# Altium schematic sheet FC_Tracker_Ver_0_0.SchDoc
size A; SheetNumber: 1; SheetTotal: 1
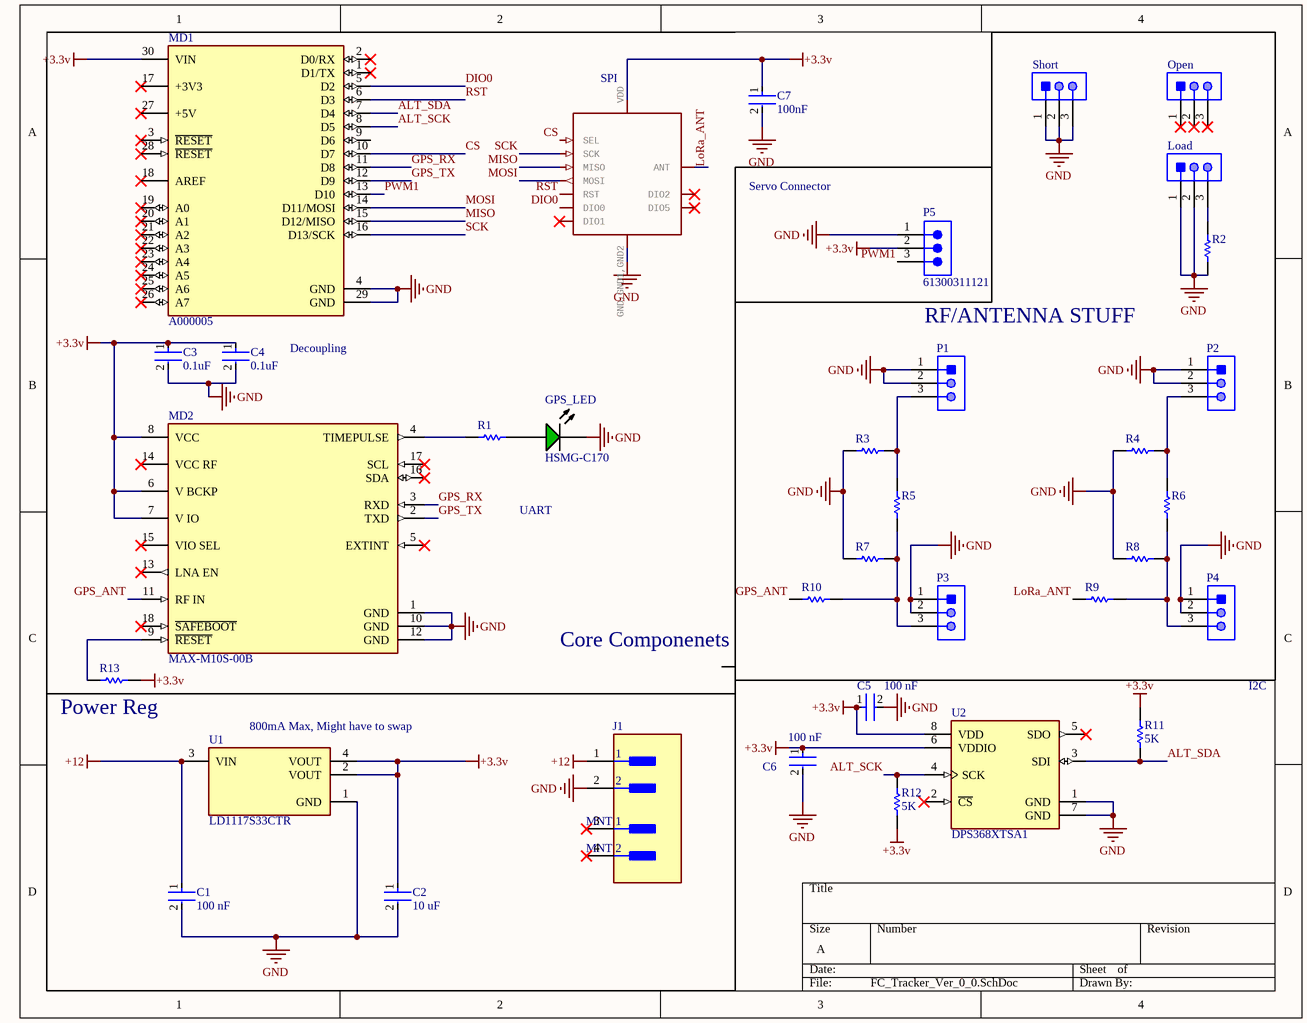
[diagram p0: FC_Tracker_Ver_0_0.SchDoc]

## Parts
1  _C2H_RFM95  [_C2H_RFM95]  (value not drawn)
C1  100 nF  [FP-CC0805-0_85-MFG]
C2  10 uF  [FP-CC0805-0_85-MFG]
C3  0.1uF  [FP-CC0805-0_85-MFG]
C4  0.1uF  [FP-CC0805-0_85-MFG]
C5  100 nF  [FP-CC0805-0_85-MFG]
C6  100 nF  [FP-CC0805-0_85-MFG]
C7  100nF  [FP-CC0805-0_85-MFG]
GPS_LED  HSMG-C170  [AVAG-HSMX-C170_V]
J1  SM02B-GHS-TB(LF)(SN)  [FP-SM02B-GHS-TB_LF_SN-MFG]  (value not drawn)
Load  U.FL-R-SMT-1(01)  [HRS-U.FL-R-SMT-3_V]  (value not drawn)
MD1  A000005  [FP-A000005-MFG]
MD2  MAX-M10S-00B  [FP-MAX-M10S-00B-MFG]
Open  U.FL-R-SMT-1(01)  [HRS-U.FL-R-SMT-3_V]  (value not drawn)
P1  U.FL-R-SMT-1(01)  [HRS-U.FL-R-SMT-3_V]  (value not drawn)
P2  U.FL-R-SMT-1(01)  [HRS-U.FL-R-SMT-3_V]  (value not drawn)
P3  U.FL-R-SMT-1(01)  [HRS-U.FL-R-SMT-3_V]  (value not drawn)
P4  U.FL-R-SMT-1(01)  [HRS-U.FL-R-SMT-3_V]  (value not drawn)
P5  61300311121  [61300311121]
R1  CRCW08050000Z0EA  [RESC2013X50X30LL20T20]  (value not drawn)
R2  CRCW08050000Z0EA  [RESC2013X50X30LL20T20]  (value not drawn)
R3  CRCW08050000Z0EA  [RESC2013X50X30LL20T20]  (value not drawn)
R4  CRCW08050000Z0EA  [RESC2013X50X30LL20T20]  (value not drawn)
R5  CRCW08050000Z0EA  [RESC2013X50X30LL20T20]  (value not drawn)
R6  CRCW08050000Z0EA  [RESC2013X50X30LL20T20]  (value not drawn)
R7  CRCW08050000Z0EA  [RESC2013X50X30LL20T20]  (value not drawn)
R8  CRCW08050000Z0EA  [RESC2013X50X30LL20T20]  (value not drawn)
R9  CRCW08050000Z0EA  [RESC2013X50X30LL20T20]  (value not drawn)
R10  CRCW08050000Z0EA  [RESC2013X50X30LL20T20]  (value not drawn)
R11  5K  [RESC1005X40X25LL05T05]
R12  5K  [RESC1005X40X25LL05T05]
R13  ERJ2GE0R00X  [RESC1005X40X25LL05T05]  (value not drawn)
Short  U.FL-R-SMT-1(01)  [HRS-U.FL-R-SMT-3_V]  (value not drawn)
U1  LD1117S33CTR  [FP-SOT-223-0046067_14-MFG]
U2  DPS368XTSA1  [FP-PG-VLGA-8-MFG]

## Nets
+3.3v: 1.VDD(VCC) C2.1 C3.1 C4.1 C5.1 C6.1 C7.1 MD1.30(VIN) MD2.6(V_BCKP) MD2.7(V_IO) MD2.8(VCC) P5.2 R11.2 R12.1 R13.2 U1.2(VOUT) U1.4(VOUT) U2.6(VDDIO) U2.8(VDD)
+12: C1.1 J1.1 U1.3(VIN)
GND: 1.GND,GND1,GND2(GND) C1.2 C2.2 C3.2 C4.2 C5.2 C6.2 C7.2 GPS_LED.2(K) J1.2 Load.1 Load.2 MD1.4(GND) MD1.29(GND) MD2.1(GND) MD2.10(GND) MD2.12(GND) P1.1 P1.2 P2.1 P2.2 P3.1 P3.2 P4.1 P4.2 P5.1 R2.1 R3.1 R4.2 R7.2 R8.2 Short.1 Short.2 Short.3 U1.1(GND) U2.1(GND) U2.7(GND)
ALT_SCK: MD1.8(D5) R12.2 U2.4(SCK)
ALT_SDA: MD1.7(D4) R11.1 U2.3(SDI)
CS: 1.NSS(SEL) MD1.10(D7)
DIO0: 1.DIO0 MD1.5(D2)
GPS_ANT: MD2.11(RF_IN) R10.1
GPS_RX: MD1.11(D8) MD2.3(RXD)
GPS_TX: MD1.12(D9) MD2.2(TXD)
LoRa_ANT: 1.ANT R9.1
MISO: 1.MISO MD1.15(D12/MISO)
MOSI: 1.MOSI MD1.14(D11/MOSI)
PWM1: MD1.13(D10) P5.3
RST: 1.RST MD1.6(D3)
SCK: 1.SCK MD1.16(D13/SCK)
NetGPS_LED_1: GPS_LED.1(A) R1.2
NetLoad_3: Load.3 R2.2
NetMD2_4: MD2.4(TIMEPULSE) R1.1
NetMD2_9: MD2.9(~{RESET}) R13.1
NetP1_3: P1.3 R3.2 R5.2
NetP2_3: P2.3 R4.1 R6.2
NetP3_3: P3.3 R5.1 R7.1 R10.2
NetP4_3: P4.3 R6.1 R8.1 R9.2

Not connected (* = marked no-connect by the designer): 1 DIO1* DIO2* DIO5*; J1 3(MNT_1)* 4(MNT_2)*; MD1 1(D1/TX)* 2(D0/RX)* 3(~{RESET})* 9(D6) 17(+3V3)* 18(AREF)* 19(A0)* 20(A1)* 21(A2)* 22(A3)* 23(A4)* 24(A5)* 25(A6)* 26(A7)* 27(+5V)* 28(~{RESET})*; MD2 5(EXTINT)* 13(LNA_EN)* 14(VCC_RF)* 15(VIO_SEL)* 16(SDA)* 17(SCL)* 18(~{SAFEBOOT})*; Open 1* 2* 3*; U2 2(~{CS})* 5(SDO)*

## Notes on the sheet
- (near 1) SPI
- Servo Connector
- Decoupling
- RF/ANTENNA STUFF
- UART
- Core Componenets
- I2C
- (near R13) Power Reg
- (near U1) 800mA Max, Might have to swap

## Library data of the parts
1 = _C2H_RFM95: GateName_1: G$1; SymbolName_1: _C2H_RFM95; LibraryName: AmbaSat-1v1-01-NO-solar; DeviceSetName: _C2H_RFM95; Package: _C2H_RFM95
C1 C5 C6 = CMP-2100-03606-3: Manufacturer Part Number: CC0805KRX7R9BB104; Manufacturer: Yageo; Tolerance: 0.1; Temperature Characteristic: X7R; Voltage Rating: 50 V; Material: Ceramic; Device Class L1: Passive Components; ComponentLink2Description: Datasheet; Package: CC0805-0.85; Digikey Description: CAP CER 0.1UF 50V X7R 0805; Capacitance: 100 nF; Device Class L3: Ceramic Capacitors; Value: 100 nF; Temperature: -30°C to +85°C; Height: 0.95mm; RoHS: TRUE; Ipc Land Pattern Name: CAPC200125X85; Device Class L2: Capacitors; Category: Cap; Temperature Range Low: -30°C; Temperature Range High: +85°C; Mouser Description: Multilayer Ceramic Capacitors MLCC - SMD/SMT 100nF 50V X7R 10%; Footprint Url: http://www.yageo.com/exep/pages/download/literatures/UPY-C_GEN_24.pdf; Automotive: No; Octopart: https://octopart.com/cc0805krx7r9bb104-yageo-192993; Lead Free: Yes; ComponentLink2URL: http://www.yageo.com/documents/recent/UPY-GPHC_Y5V_6.3V-to-50V_8.pdf
C2 = CMP-2100-03606-3: Manufacturer Part Number: CC0805KRX7R9BB104; Manufacturer: Yageo; Tolerance: 0.1; Capacitance: 100 nF; Value: 100 nF; Temperature Characteristic: X7R; Voltage Rating: 50 V; Material: Ceramic; Device Class L1: Passive Components; ComponentLink2Description: Datasheet; Package: CC0805-0.85; Digikey Description: CAP CER 0.1UF 50V X7R 0805; Device Class L3: Ceramic Capacitors; Temperature: -30°C to +85°C; Height: 0.95mm; RoHS: TRUE; Ipc Land Pattern Name: CAPC200125X85; Device Class L2: Capacitors; Category: Cap; Temperature Range Low: -30°C; Temperature Range High: +85°C; Mouser Description: Multilayer Ceramic Capacitors MLCC - SMD/SMT 100nF 50V X7R 10%; Footprint Url: http://www.yageo.com/exep/pages/download/literatures/UPY-C_GEN_24.pdf; Automotive: No; Octopart: https://octopart.com/cc0805krx7r9bb104-yageo-192993; Lead Free: Yes; ComponentLink2URL: http://www.yageo.com/documents/recent/UPY-GPHC_Y5V_6.3V-to-50V_8.pdf
C3 C4 = CMP-2100-03606-3: CAP CER 0.1UF 50V X7R 0805; Manufacturer Part Number: CC0805KRX7R9BB104; Manufacturer: Yageo; Tolerance: 0.1; Capacitance: 100 nF; Value: 100 nF; Material: Ceramic; Device Class L1: Passive Components; ComponentLink2Description: Datasheet; Package: CC0805-0.85; Digikey Description: CAP CER 0.1UF 50V X7R 0805; Device Class L3: Ceramic Capacitors; Temperature: -30°C to +85°C; Temperature Characteristic: X7R; Voltage Rating: 50 V; Height: 0.95mm; RoHS: TRUE; Ipc Land Pattern Name: CAPC200125X85; Device Class L2: Capacitors; Category: Cap; Temperature Range Low: -30°C; Temperature Range High: +85°C; Mouser Description: Multilayer Ceramic Capacitors MLCC - SMD/SMT 100nF 50V X7R 10%; Footprint Url: http://www.yageo.com/exep/pages/download/literatures/UPY-C_GEN_24.pdf; Automotive: No; Octopart: https://octopart.com/cc0805krx7r9bb104-yageo-192993; Lead Free: Yes; ComponentLink2URL: http://www.yageo.com/documents/recent/UPY-GPHC_Y5V_6.3V-to-50V_8.pdf
C7 = CMP-2100-03606-3: CAP CER 0.1UF 50V X7R 0805; Manufacturer Part Number: CC0805KRX7R9BB104; Manufacturer: Yageo; Tolerance: 0.1; Description: CC0805 100 nF X7R 10.00% 50 V; Material: Ceramic; Device Class L1: Passive Components; ComponentLink2Description: Datasheet; Package: CC0805-0.85; Digikey Description: CAP CER 0.1UF 50V X7R 0805; Capacitance: 100 nF; Device Class L3: Ceramic Capacitors; Value: 100 nF; Temperature: -30°C to +85°C; Temperature Characteristic: X7R; Voltage Rating: 50 V; Height: 0.95mm; RoHS: TRUE; Ipc Land Pattern Name: CAPC200125X85; Device Class L2: Capacitors; Category: Cap; Temperature Range Low: -30°C; Temperature Range High: +85°C; Mouser Description: Multilayer Ceramic Capacitors MLCC - SMD/SMT 100nF 50V X7R 10%; Footprint Url: http://www.yageo.com/exep/pages/download/literatures/UPY-C_GEN_24.pdf; Automotive: No; Octopart: https://octopart.com/cc0805krx7r9bb104-yageo-192993; Lead Free: Yes; ComponentLink2URL: http://www.yageo.com/documents/recent/UPY-GPHC_Y5V_6.3V-to-50V_8.pdf
GPS_LED = CMP-2000-05062-1: Chip LED, Green, 2.2 V, -40 to 85 degC, 2-Pin SMD, Pb-Free, Tape and Reel; Manufacturer: Avago; No. of Pins: 2; Peak Wavelength: 570nm; SVHC: NoSVHC(16-Jun-2014); Dominant Wavelength: 572nm; Forward Current If: 20mA; Viewing Angle: 170deg; Lens Shape: Rectangular; PIV Max: 5V; External Width: 1.25mm; LED Type: Standard; External Depth: 0.8mm; Opto Mounting Orientation: Top; Luminous Intensity: 15mcd; Luminous Intensity Min: 4mcd; Forward Voltage VF Max: 2.6V; External Length / Height: 2mm; Bulb Size: 1.25mmx1.4mm; Light Area Height: 1mm; Voltage Vf Typ: 2.2V; Operating Temperature Max: 85degC; Datasheet Version: Oct-08; MSL: MSL2A-4weeks; Peak Forward Current: 20mA; Package Description: 2-Pin Surface Mount Device, Body 2 x 1.25 mm, Height 0.8 mm; Datasheet URL: https://datasheet.ciiva.com/29280/180495-da-01-en-chip-led-hsmg-c170-gelb-gruen-29280971.pdf; Storage Temperature Min: -40degC; LED Colour: Green; Wavelength Typ: 570nm; Mounting Type: SMD; Forward Current If Max: 20mA; Dominant Wavelength Typ: 572nm; LED Mounting: SMD; Operating Temperature Range: -30degCto+85degC; Operating Temperature Min: -30degC; Manufacturer URL: http://www.avagotech.com/; Packaging: CutTape; Luminous Intensity Typ: 15mcd; Package Reference: HSMX-C170; Storage Temperature Max: 85degC; Opto Case Style: SMD; Forward Voltage: 2.2V
J1 = CMP-2000-07076-2: CONN HEADER SMD R/A 2POS 1.25MM; Voltage Rating: 50V; Number of Positions: 2; Pitch: 0.049inch; Current Rating: 1A; Connector Type: Outer Shroud Contact; Number of Rows: 1; Contact Material: Bronze; Termination: Solder; Color: Natural; Package Quantity: 2500; Mount: Surface Mount; Housing Color: Natural; Number of Contacts: 2; Packaging: Tape and Reel; Lead Free: Lead Free; Housing Material: Nylon; Orientation: Right Angle; Contact Type: Male Pin; Contact Plating: Tin; Series: GH; Fastening Type: Latch
Load Open P1-P4 Short = CMP-2000-05153-1: Ultra Small Coaxial Connector, 6 GHz, -40 to 90 degC, 3-Pin SMD, RoHS, Bulk; Manufacturer: Hirose Electric; Connector Style: U.FL; Impedance: 50Ohm; Dielectric Material: LiquidCrystalPolymer(LCP); Minimum Quantity: UltraMiniatureCoaxial; Online Catalog: U.FLSeries; Featured Product: HiroseU.FLSeries; Frequency - Max: 6GHz; Other Names: H122041 / U.FL-R-SMT-1(01)-ND; Contact Termination: Solder; Body Material: PhosphorBronze; Connector Type: Jack,MalePin; Body Finish: Silver; Center Contact Plating: Gold; Manufacturer URL: https://www.hirose.com; Family: CoaxialConnectors(RF); Fastening Type: Snap-On; Unit PriceUSD: U.FL; Series: U.FL; Package Reference: U.FL-R-SMT; Packaging: Bulk; Standard Package: 100; Mounting Type: SurfaceMount; Quantity Available: Bulk; Housing Color: Silver; Package Description: 3-Pin Surface Mount Device, Body 2.6 x 2.6 mm; Category: Connectors,Interconnects; Operating Temperature: -40degC~90degC; Center Contact Material: PhosphorBronze; Dynamic Catalog: U.FLSeries; Datasheet URL: https://datasheet.ciiva.com/26945/getdatasheetpartid-475239-26945414.pdf; Datasheet Version: Feb-09; Shield Termination: Solder
MD1 = CMP-189986-000002-1: ARDUINO NANO ATMEGA328 EVAL BRD; Number of Bits: 8; Evaluation Kit: Yes; Operating Supply Voltage: 12V; Interface: I2C; Data Bus Width: 8b; Core Architecture: AVR; Packaging: Bulk; Length: 7inch; Package Quantity: 50; Width: 5inch; REACH SVHC: No SVHC; Weight: 0.358383oz; Series: AVR® ATmega; Height: 0.25inch
MD2 = CMP-207130-000026-1: GNSS LCC RX, ROM, TCXO, LNA, SAW
P5 = CMP-1502-01062-3: NexarPartId: 32855521; Current Rating: 3A; Voltage Rating: 250V; Number of Positions: 3; Pitch: 2.54mm; Contact Resistance: 20mΩ; Connector Type: Male Pin; Gender: Male; REACH SVHC: Unknown; Packaging: Bulk; Contact Material: Copper; Min Operating Temperature: -40°C; Number of Rows: 1; Orientation: Vertical; RoHS: Compliant; Contact Plating: Gold; Max Operating Temperature: 105°C; Mount: Through Hole; Height: 8.94mm; Operating Supply Voltage: 250V; Number of Pins: 3; Contact Mating Length: 5.9944mm; Number of Contacts: 3; Color: Black; Lead Free: Lead Free; Lead Pitch: 2.54mm; Termination: Solder
R1 R3-R10 = CMP-2001-04896-1: Manufacturer: Vishay Dale; Part Number: CRCW08050000Z0EA
R2 = CMP-2001-04896-1: 50 Ohm; Manufacturer: Vishay Dale; Part Number: CRCW08050000Z0EA
R11 = CMP-2000-07451-1: 5KOhm; Manufacturer: Panasonic; Voltage Rating (DC): 50V; Temperature Coefficient: 600ppm/��C; Max Power Dissipation: 100mW; Resistance: 0mOhm; Tolerance: 5%; Number of Terminations: 2; Mount: SurfaceMount; Height: 0.35mm; Packaging: TapeandReel; Contact Plating: Tin; Manufacturer URL: http://www.panasonic.com/; Composition: ThickFilm; Max Operating Temperature: 155degC; REACH SVHC: NoSVHC; Case/Package: 0402; Package Reference: 402; Depth: 0.5mm; Package Description: 2-Pin Surface Mount Device, Body 1 x 0.5 mm; Datasheet URL: https://industrial.panasonic.com/cdbs/www-data/pdf/RDA0000/AOA0000C301.pdf; RoHSCompliant: True; Case Code (Imperial): 0402; Military Standard: Not; Min Operating Temperature: -55degC; Power Rating: 100mW; Datasheet Version: 03/2015; Length: 1mm; Case Code (Metric): 1005; Termination: SMD/SMT; Mounting Technology: SurfaceMount; Voltage Rating: 50V; Width: 0.02inch; Package Quantity: 1; Lead Free: LeadFree; Radiation Hardening: No
R12 = CMP-2000-07451-1: 5 KOhm; Manufacturer: Panasonic; Voltage Rating (DC): 50V; Temperature Coefficient: 600ppm/��C; Max Power Dissipation: 100mW; Resistance: 0mOhm; Tolerance: 5%; Number of Terminations: 2; Mount: SurfaceMount; Height: 0.35mm; Packaging: TapeandReel; Contact Plating: Tin; Manufacturer URL: http://www.panasonic.com/; Composition: ThickFilm; Max Operating Temperature: 155degC; REACH SVHC: NoSVHC; Case/Package: 0402; Package Reference: 402; Depth: 0.5mm; Package Description: 2-Pin Surface Mount Device, Body 1 x 0.5 mm; Datasheet URL: https://industrial.panasonic.com/cdbs/www-data/pdf/RDA0000/AOA0000C301.pdf; RoHSCompliant: True; Case Code (Imperial): 0402; Military Standard: Not; Min Operating Temperature: -55degC; Power Rating: 100mW; Datasheet Version: 03/2015; Length: 1mm; Case Code (Metric): 1005; Termination: SMD/SMT; Mounting Technology: SurfaceMount; Voltage Rating: 50V; Width: 0.02inch; Package Quantity: 1; Lead Free: LeadFree; Radiation Hardening: No
R13 = CMP-2000-07451-1: Chip Resistor, 0 Ohm, 0.1 W, -55 to 155 degC, 0402 (1005 Metric), RoHS, Tape and Reel; Manufacturer: Panasonic; Voltage Rating (DC): 50V; Temperature Coefficient: 600ppm/��C; Max Power Dissipation: 100mW; Resistance: 0mOhm; Tolerance: 5%; Number of Terminations: 2; Mount: SurfaceMount; Height: 0.35mm; Packaging: TapeandReel; Contact Plating: Tin; Manufacturer URL: http://www.panasonic.com/; Composition: ThickFilm; Max Operating Temperature: 155degC; REACH SVHC: NoSVHC; Case/Package: 0402; Package Reference: 402; Depth: 0.5mm; Package Description: 2-Pin Surface Mount Device, Body 1 x 0.5 mm; Datasheet URL: https://industrial.panasonic.com/cdbs/www-data/pdf/RDA0000/AOA0000C301.pdf; RoHSCompliant: True; Case Code (Imperial): 0402; Military Standard: Not; Min Operating Temperature: -55degC; Power Rating: 100mW; Datasheet Version: 03/2015; Length: 1mm; Case Code (Metric): 1005; Termination: SMD/SMT; Mounting Technology: SurfaceMount; Voltage Rating: 50V; Width: 0.02inch; Package Quantity: 1; Lead Free: LeadFree; Radiation Hardening: No
U1 = CMP-0244-00307-2: IC REG LINEAR 3.3V 800MA SOT223; Input Bias Current: 5mA; Output Voltage Accuracy: 1%; Dropout Voltage: 1.1V; Power Dissipation: 12W; Polarity: Positive; Min Input Voltage: 5.3V; Quiescent Current: 10mA; Max Output Current: 1.3A; Output Current: 950mA; Number of Regulators: 1; Max Supply Voltage: 15V; Output Type: Fixed; Output Voltage: 3.3V; Number of Terminals: 4; Min Supply Voltage: 3.3V; Termination: SMD/SMT; Mount: Surface Mount; Max Power Dissipation: 12W; Case/Package: SOT-223; Lead Free: Lead Free; Height: 1.8mm; REACH SVHC: No SVHC; Radiation Hardening: No; Width: 3.5mm; Length: 6.5mm; Packaging: Tape and Reel; Max Input Voltage: 15V; Accuracy: 1%; Weight: 0.01lb; Contact Plating: Tin; Max Operating Temperature: 125°C; Number of Pins: 4; Max Output Voltage: 3.3V; Min Operating Temperature: -40°C; Nominal Output Voltage: 3.3V; Package Quantity: 1; Min Output Voltage: 3.3V; Number of Outputs: 1
U2 = CMP-32885-000001-1: DIGITAL PRESSURE SENSOR; Manufacturer: Infineon; Port Style: No Port; Operating Supply Current: 345uA; Min Supply Voltage: 1.2V; Sensor Output: I2C,SPI; Max Supply Voltage: 3.6V; Ambient Temperature Range Low: -40°C; Temperature: -40°C to +85°C; Ambient Temperature Range High: +85°C; Device Class L2: Pressure Sensors; ComponentLink2Description: Datasheet; Footprint Url: https://www.infineon.com/cms/en/product/packages/PG-VLGA/PG-VLGA-8-2/; Category: IC; Lead Free: Yes; RoHS: TRUE; Temperature Range High: +85°C; Manufacturer Part Number: DPS368XTSA1; Digikey Description: DIGITAL PRESSURE SENSOR; ComponentLink2URL: https://www.infineon.com/dgdl/Infineon-DPS368-DataSheet-v01_01-EN.pdf?fileId=5546d46269e1c019016a0c45105d4b40; Height: 1.1mm; Package: PG-VLGA-8; Device Class L1: Sensors; Automotive: No; Temperature Range Low: -40°C; Device Class L3: unset; Octopart: https://octopart.com/dps368xtsa1-infineon-98278029